# Altium schematic sheet LVDS_Port.SchDoc
size A4
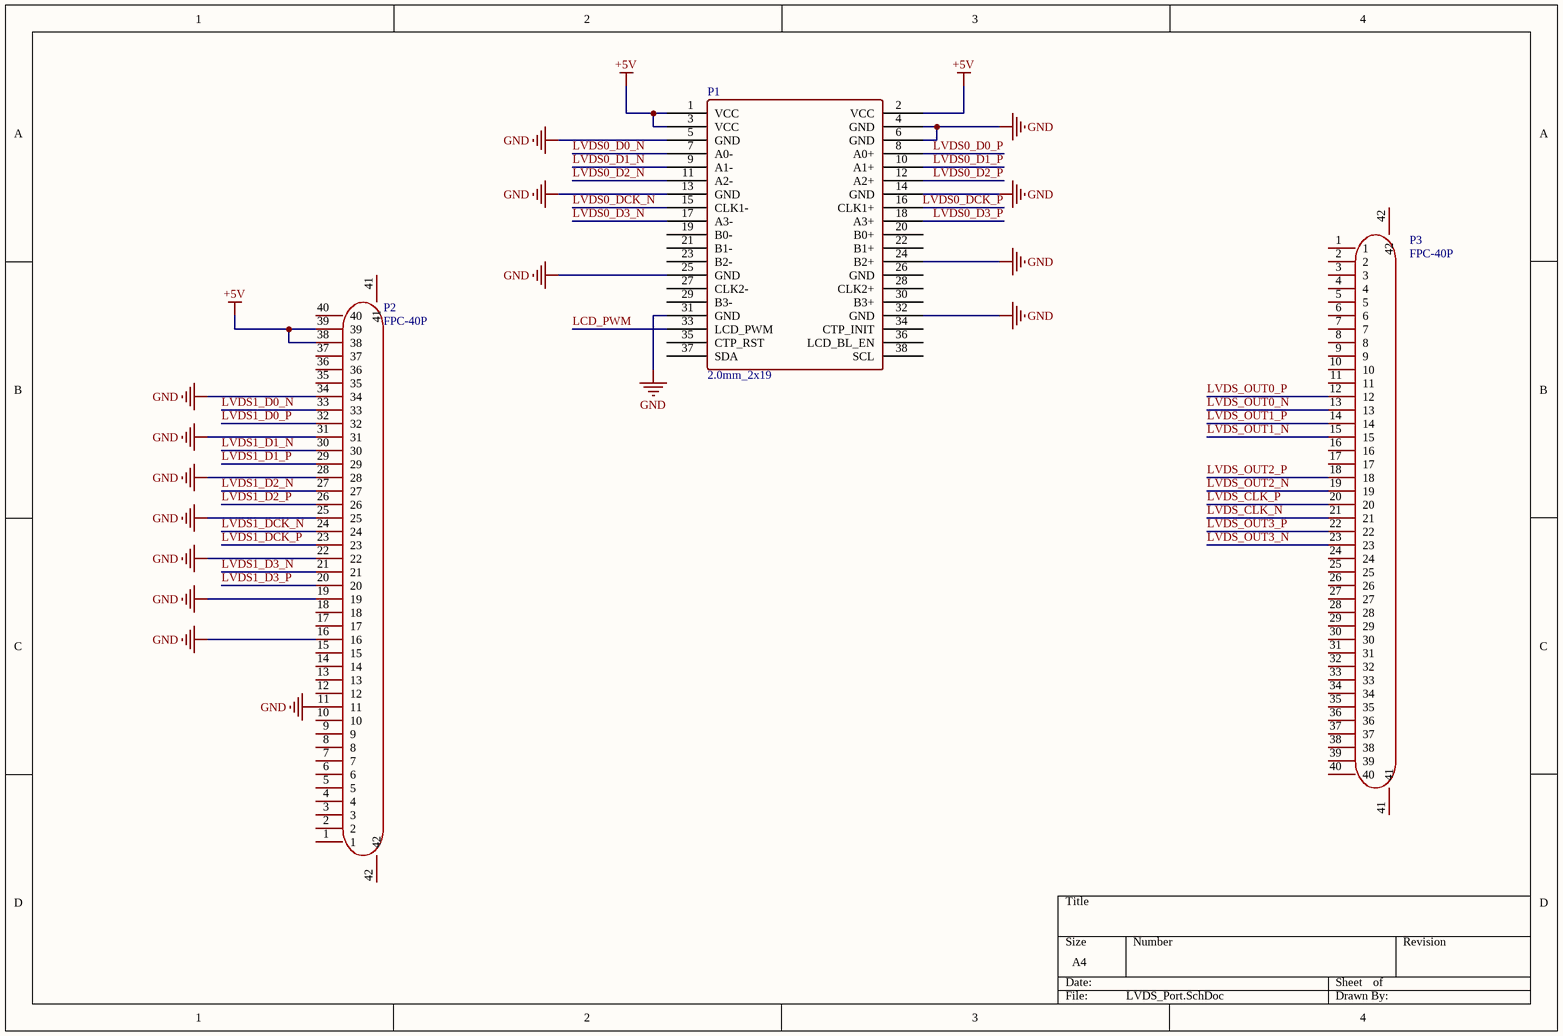
[diagram p0: LVDS_Port.SchDoc]

## Parts
P1  2.0mm_2x19  [2.0mm_2x19]
P2  FPC-40P  [FPC-40P]
P3  FPC-40P  [FPC-40P]

## Nets
+5V: P1.1(VCC) P1.2(VCC) P1.3(VCC) P2.38 P2.39
GND: P1.4(GND) P1.5(GND) P1.6(GND) P1.13(GND) P1.14(GND) P1.24(B2+) P1.25(GND) P1.31(GND) P1.32(GND) P2.11 P2.16 P2.19 P2.22 P2.25 P2.28 P2.31 P2.34
LCD_PWM: P1.33(LCD_PWM)
LVDS0_D0_N: P1.7(A0-)
LVDS0_D0_P: P1.8(A0+)
LVDS0_D1_N: P1.9(A1-)
LVDS0_D1_P: P1.10(A1+)
LVDS0_D2_N: P1.11(A2-)
LVDS0_D2_P: P1.12(A2+)
LVDS0_D3_N: P1.17(A3-)
LVDS0_D3_P: P1.18(A3+)
LVDS0_DCK_N: P1.15(CLK1-)
LVDS0_DCK_P: P1.16(CLK1+)
LVDS1_D0_N: P2.33
LVDS1_D0_P: P2.32
LVDS1_D1_N: P2.30
LVDS1_D1_P: P2.29
LVDS1_D2_N: P2.27
LVDS1_D2_P: P2.26
LVDS1_D3_N: P2.21
LVDS1_D3_P: P2.20
LVDS1_DCK_N: P2.24
LVDS1_DCK_P: P2.23
LVDS_CLK_N: P3.21
LVDS_CLK_P: P3.20
LVDS_OUT0_N: P3.13
LVDS_OUT0_P: P3.12
LVDS_OUT1_N: P3.15
LVDS_OUT1_P: P3.14
LVDS_OUT2_N: P3.19
LVDS_OUT2_P: P3.18
LVDS_OUT3_N: P3.23
LVDS_OUT3_P: P3.22

Not connected (* = marked no-connect by the designer): P1 19(B0-) 20(B0+) 21(B1-) 22(B1+) 23(B2-) 26(GND) 27(CLK2-) 28(CLK2+) 29(B3-) 30(B3+) 34(CTP_INIT) 35(CTP_RST) 36(LCD_BL_EN) 37(SDA) 38(SCL); P2 1 2 3 4 5 6 7 8 9 10 12 13 14 15 17 18 35 36 37 40 41 42; P3 1 2 3 4 5 6 7 8 9 10 11 16 17 24 25 26 27 28 29 30 31 32 33 34 35 36 37 38 39 40 41 42

## Library data of the parts
P2 P3 = FPC-40P: 下接上翻盖